# Altium project TPI_Carte_Alimentation.PrjPcb
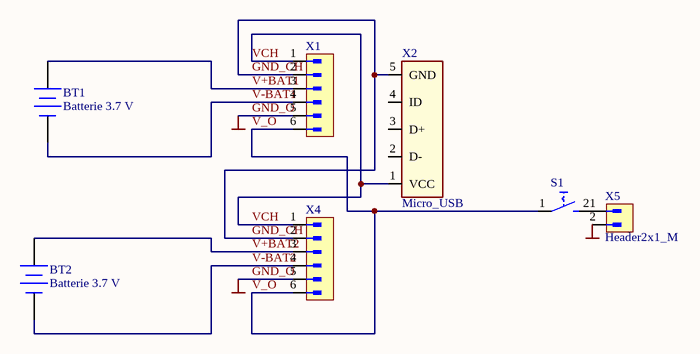
[diagram p0: TPI_Carte_Alimentation.SchDoc]
1 sheet, 7 parts. Net scope: global (net labels, ports and power ports of the same name join across sheets).
Board file: TPI_Carte_Alimentation.PcbDoc

## Sheet TPI_Carte_Alimentation.SchDoc: TPI_Carte_Alimentation
size 297 x 209 mm; Author: Rafael Donadello; DrawnBy: Rafael Donadello; Engineer: Rafael Donadello; Organization1: Centre professionnel; Address1: Rue Roger-de-Guimps 41; Address2: CH-1401 Yverdon-les-Bains; Address4: Switzerland; Revision: 1; SheetNumber: 1; SheetTotal: 1; Organization2: du Nord vaudois; ProjectNumber: 1

### Parts
BT1  Batterie 3.7 V  [18650Holder_V1]
BT2  Batterie 3.7 V  [18650Holder_V1]
S1  ?  [MOLEX_0022284020]  (value not drawn)
X1  Header6x1_M  [HDR6X1_M]  (value not drawn)
X2  Micro_USB  [MICRO_USB]
X4  Header6x1_M  [HDR6X1_M]  (value not drawn)
X5  Header2x1_M  [HDR2X1_M]

### Nets
GND_O: X1.5 X4.5 X5.2  [also labelled GND]
GND_CH: X1.2 X2.5(GND) X4.2
V+BAT1: BT1.1(+) X1.3
V+BAT2: BT2.1(+) X4.3
V-BAT1: BT1.2(-) X1.4
V-BAT2: BT2.2(-) X4.4
V_O: S1.1 X1.6 X4.6
VCH: X1.1 X2.1(VCC) X4.1
NetS1_2: S1.2 X5.1

Not connected (* = marked no-connect by the designer): X2 2(D-) 3(D+) 4(ID)

### Notes on the sheet
- Date:
- Auteur:
- File:
- Format:
- Rev.
- of
- A4

### Library data of the parts
BT1 BT2 = Battery: Multicell Battery; Published: 24-Mar-1999; LatestRevisionDate: 17-Jul-2002; LatestRevisionNote: Re-released for DXP Platform.; PackageReference: BAT-2; Publisher: Altium Limited; PackageDescription: Battery; 2 Leads
S1 = Switch_NO: Switch Normaly Open
X1 X4 = CMP-031-000013-3: WURTH ELEKTRONIK - 61300611121 - Pin Header, Board-to-Board, 2.54 mm, 1 Rows, 6 Contacts, Through Hole, WR-PHD Series; Manufacturer: Wurth Electronics; Connector Type: Male Pin; Number of Positions: 6; Pitch: 0.1inch; Gender: Male; Voltage Rating: 250V; Current Rating: 3A; Pricing 2: 1=0.33000, 10=0.27900, 25=0.23200, 50=0.19400, 100=0.17600, 1000=0.16000 (USD); Termination: Through Hole; Pricing 1: 1=0.33000, 10=0.27900, 50=0.19400, 100=0.17600, 1000=0.16000, 10000=0.16000 (USD); Number of Rows: 1; Housing Material: PBT; Mount: Through Hole; Stock 1: 7278; Design Item ID: Header6x1_M; REACH SVHC: Unknown; ComponentLink1URL: http://www.mouser.com/ds/2/445/6130xx11121-538006.pdf?src-supplier=Mouser; ComponentLink1Description: http://www.mouser.com/ds/2/445/6130xx11121-538006.pdf?src-supplier=Mouser; Stock 2: 46170; RoHS: Yes; Manufacturer Part Number: 61300611121; ComponentLink3URL: http://www.farnell.com/cad/1737268.pdf?src-supplier=Element14; Contact Gender: Male; ComponentLink2Description: https://katalog.we-online.de/em/datasheet/6130xx11121.pdf?src-supplier=Digi-Key; Contact Material: Copper Alloy,Copper; Max Operating Temperature: 125°C; Packaging: Bulk; Min Operating Temperature: -40°C; Color: Black; Number of Contacts: 6; Lead Free: Lead Free; Contact Mating Length: 0.236inch; Source: MEION_Connectors.SchLib; ComponentLink2URL: https://katalog.we-online.de/em/datasheet/6130xx11121.pdf?src-supplier=Digi-Key; Contact Plating: Gold; Category: Headers and Wire Housings; ComponentLink3Description: http://www.farnell.com/cad/1737268.pdf?src-supplier=Element14
X5 = CMP-031-000003-4: WR-PHD 2.54 mm THT Pin Header; Manufacturer Part Number: 61300211121; Manufacturer: Wurth Electronics; Gender: Male; Number of Contacts: 2; Pitch: 0.1inch; Voltage Rating: 250V; Connector Type: Male Pin; Current Rating: 3A; ComponentLink1Description: https://datasheet.ciiva.com/13619/6130xx11121-48870-13619345.pdf?src-supplier=Mouser; Contact Plating: Gold; Lead Free: Lead Free; Color: Black; RoHS: Yes; Min Operating Temperature: -40°C; Number of Rows: 1; ComponentLink1URL: https://datasheet.ciiva.com/13619/6130xx11121-48870-13619345.pdf?src-supplier=Mouser; Number of Positions: 2; Packaging: Bulk; REACH SVHC: Unknown; Contact Material: Copper Alloy,Copper; Stock 1: 68226; Housing Material: PBT; Mount: Through Hole; Contact Gender: Male; Category: Headers and Wire Housings; Source: MEION_Connectors.SchLib; Max Operating Temperature: 125°C; Termination: Through Hole; Design Item ID: Header2x1_M; Contact Mating Length: 0.236inch
X2 = Micro_USB: Supplier Part Number: 609-4613-2-ND; Supplier 1: Digi-Key